# Altium schematic sheet Drives_M.2.SchDoc
size 420 x 297 mm
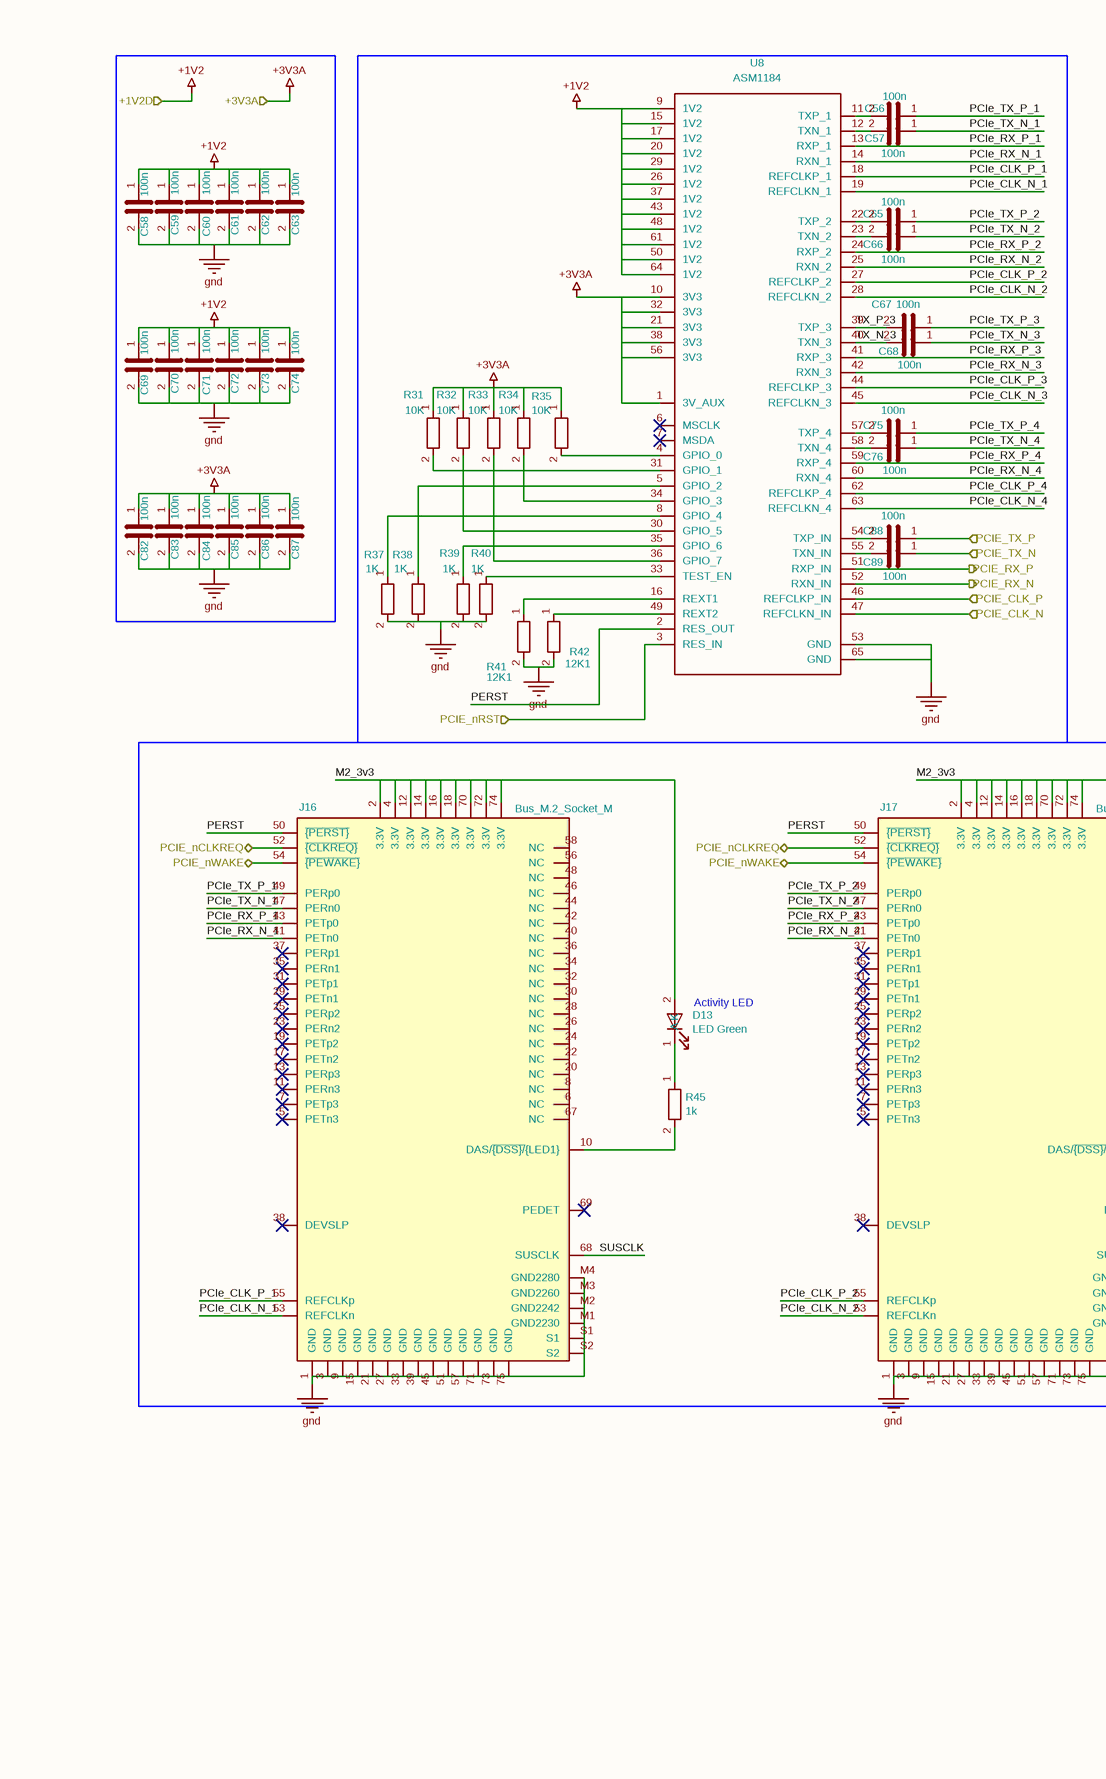
[diagram p0: Drives_M.2.SchDoc, left]
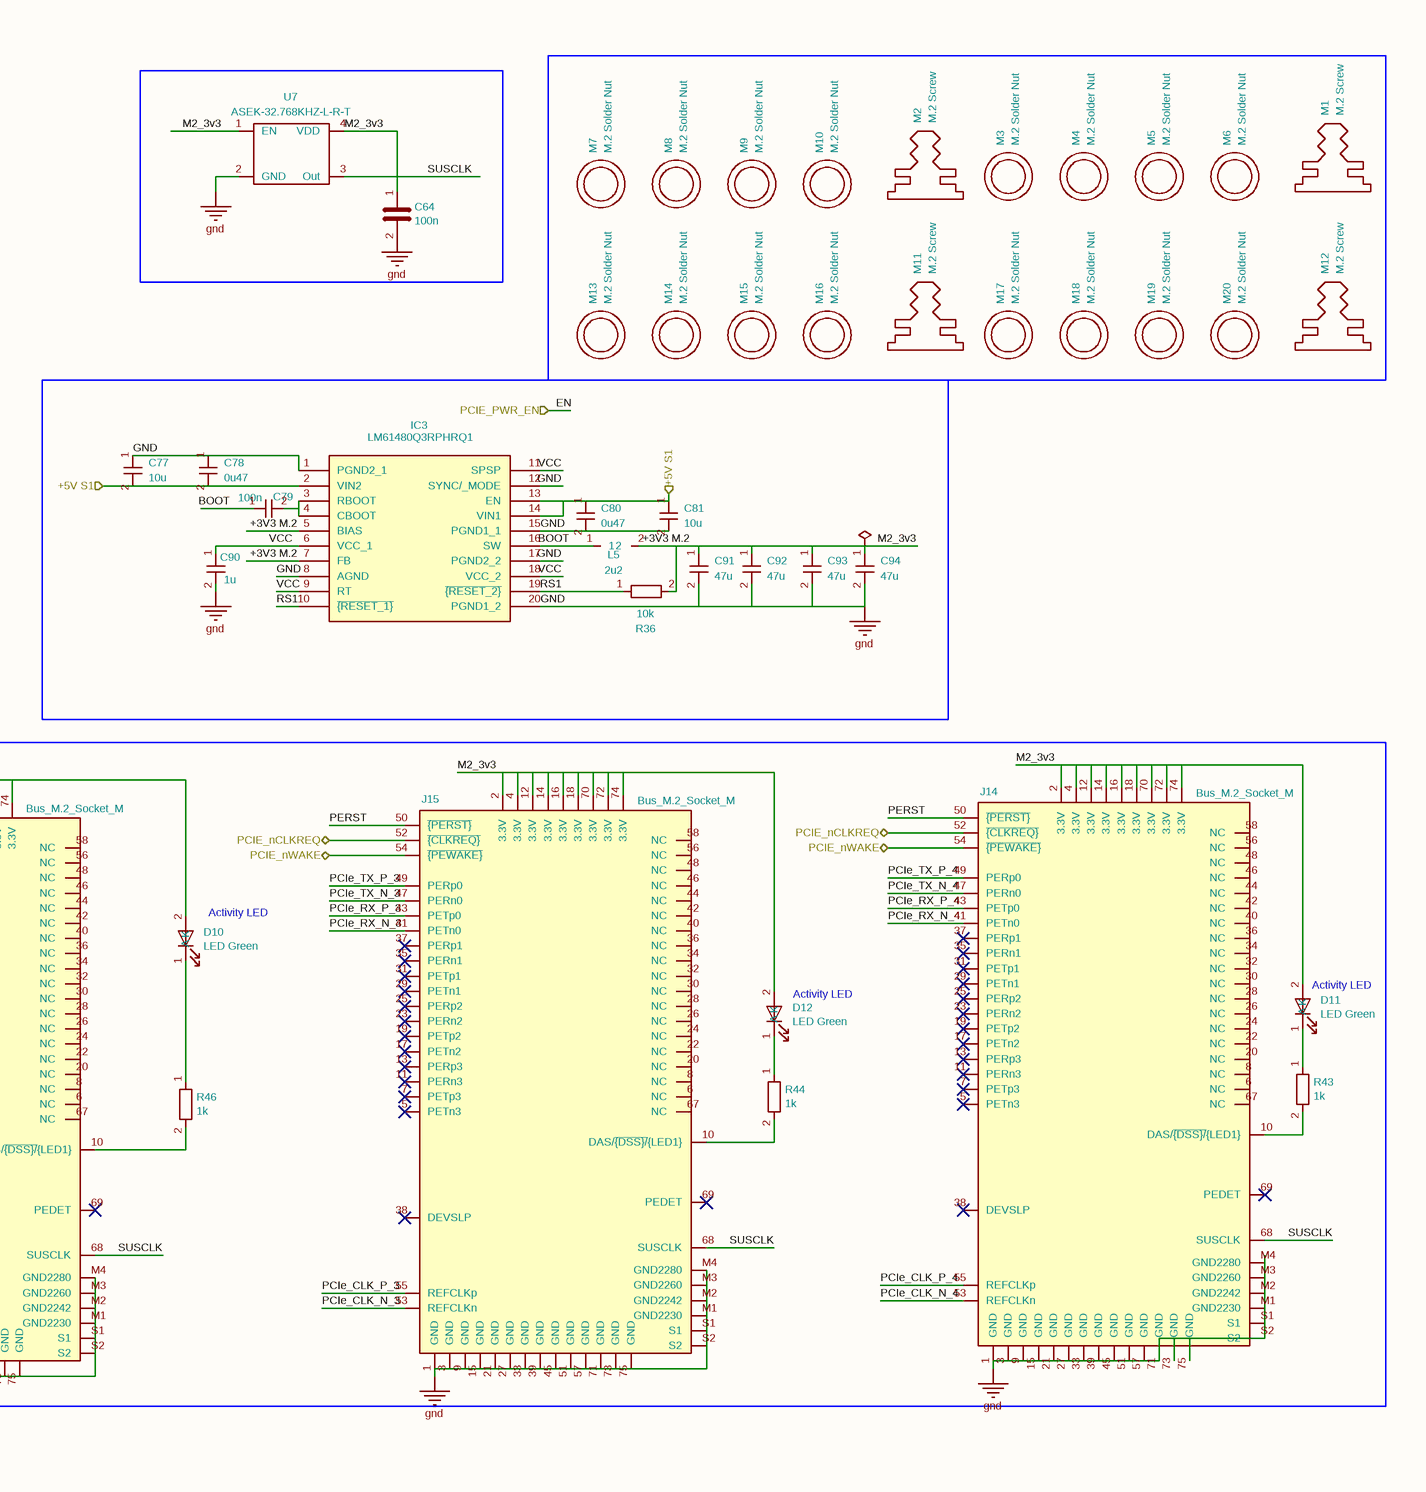
[diagram p1: Drives_M.2.SchDoc, right]

## Parts
#FLG09  PWR_FLAG  (value not drawn)  (graphical)
C56  100n  [C_0402_1005Metric]
C57  100n  [C_0402_1005Metric]
C58  100n  [C_0402_1005Metric]
C59  100n  [C_0402_1005Metric]
C60  100n  [C_0402_1005Metric]
C61  100n  [C_0402_1005Metric]
C62  100n  [C_0402_1005Metric]
C63  100n  [C_0402_1005Metric]
C64  100n  [C_0402_1005Metric]
C65  100n  [C_0402_1005Metric]
C66  100n  [C_0402_1005Metric]
C67  100n  [C_0402_1005Metric]
C68  100n  [C_0402_1005Metric]
C69  100n  [C_0402_1005Metric]
C70  100n  [C_0402_1005Metric]
C71  100n  [C_0402_1005Metric]
C72  100n  [C_0402_1005Metric]
C73  100n  [C_0402_1005Metric]
C74  100n  [C_0402_1005Metric]
C75  100n  [C_0402_1005Metric]
C76  100n  [C_0402_1005Metric]
C77  10u  [C_0805_2012Metric]
C78  0u47  [C_0603_1608Metric]
C79  100n  [C_0402_1005Metric]
C80  0u47  [C_0603_1608Metric]
C81  10u  [C_0805_2012Metric]
C82  100n  [C_0402_1005Metric]
C83  100n  [C_0402_1005Metric]
C84  100n  [C_0402_1005Metric]
C85  100n  [C_0402_1005Metric]
C86  100n  [C_0402_1005Metric]
C87  100n  [C_0402_1005Metric]
C88  100n  [C_0402_1005Metric]
C89  100n  [C_0402_1005Metric]
C90  1u  [C_0805_2012Metric]
C91  47u  [C_0805_2012Metric]
C92  47u  [C_0805_2012Metric]
C93  47u  [C_0805_2012Metric]
C94  47u  [C_0805_2012Metric]
D10  LED Green  [LED_0603_1608Metric]
D11  LED Green  [LED_0603_1608Metric]
D12  LED Green  [LED_0603_1608Metric]
D13  LED Green  [LED_0603_1608Metric]
IC3  LM61480Q3RPHRQ1  [LM62460QRPHRQ1]
J14  Bus_M.2_Socket_M  [21991195]
J15  Bus_M.2_Socket_M  [21991195]
J16  Bus_M.2_Socket_M  [21991195]
J17  Bus_M.2_Socket_M  [21991195]
L5  2u2  [SRN50402R2Y]
M1  M.2 Screw
M2  M.2 Screw
M3  M.2 Solder Nut
M4  M.2 Solder Nut
M5  M.2 Solder Nut
M6  M.2 Solder Nut
M7  M.2 Solder Nut
M8  M.2 Solder Nut
M9  M.2 Solder Nut
M10  M.2 Solder Nut
M11  M.2 Screw
M12  M.2 Screw
M13  M.2 Solder Nut
M14  M.2 Solder Nut
M15  M.2 Solder Nut
M16  M.2 Solder Nut
M17  M.2 Solder Nut
M18  M.2 Solder Nut
M19  M.2 Solder Nut
M20  M.2 Solder Nut
R31  10K  [R_0603_1608Metric]
R32  10K  [R_0603_1608Metric]
R33  10K  [R_0603_1608Metric]
R34  10K  [R_0603_1608Metric]
R35  10K  [R_0603_1608Metric]
R36  10k  [R_0402_1005Metric]
R37  1K  [R_0603_1608Metric]
R38  1K  [R_0603_1608Metric]
R39  1K  [R_0603_1608Metric]
R40  1K  [R_0603_1608Metric]
R41  12K1  [R_0603_1608Metric]
R42  12K1  [R_0603_1608Metric]
R43  1k  [R_0603_1608Metric]
R44  1k  [R_0603_1608Metric]
R45  1k  [R_0603_1608Metric]
R46  1k  [R_0603_1608Metric]
U7  ASEK-32.768KHZ-L-R-T  [Crystal_SMD_3225-4Pin_3.2x2.5mm]
U8  ASM1184  [QFN-64-1EP_9x9mm_P0.5mm_EP5.2x5.2mm_ThermalVias]

## Ports
+1V2D (in), +3V3A (in), +5V S1 (in), PCIE_CLK_N (in), PCIE_CLK_P (in), PCIE_nCLKREQ (bidir), PCIE_nRST (in), PCIE_nWAKE (bidir), PCIE_PWR_EN (in), PCIE_RX_N (out), PCIE_RX_P (out), PCIE_TX_N (in), PCIE_TX_P (in)

## Nets
+1V2: C58.1 C59.1 C60.1 C61.1 C62.1 C63.1 C69.1 C70.1 C71.1 C72.1 C73.1 C74.1 U8.9(1V2) U8.15(1V2) U8.17(1V2) U8.20(1V2) U8.26(1V2) U8.29(1V2) U8.37(1V2) U8.43(1V2) U8.48(1V2) U8.50(1V2) U8.61(1V2) U8.64(1V2) ; port +1V2D
+3V3A: C82.1 C83.1 C84.1 C85.1 C86.1 C87.1 R31.1 R32.1 R33.1 R34.1 R35.1 U8.1(3V_AUX) U8.10(3V3) U8.21(3V3) U8.32(3V3) U8.38(3V3) U8.56(3V3) ; port +3V3A
GND: C58.2 C59.2 C60.2 C61.2 C62.2 C63.2 C64.2 C69.2 C70.2 C71.2 C72.2 C73.2 C74.2 C77.1 C78.1 C80.2 C81.2 C82.2 C83.2 C84.2 C85.2 C86.2 C87.2 C90.2 C91.2 C92.2 C93.2 C94.2 IC3.1(PGND2_1) IC3.8(AGND) IC3.12(SYNC/_MODE) IC3.15(PGND1_1) IC3.17(PGND2_2) IC3.20(PGND1_2) J14.1(GND) J14.3(GND) J14.9(GND) J14.15(GND) J14.21(GND) J14.27(GND) J14.33(GND) J14.39(GND) J14.45(GND) J14.51(GND) J14.57(GND) J14.71(GND) J14.73(GND) J14.75(GND) J14.M1(GND2230) J14.M2(GND2242) J14.M3(GND2260) J14.M4(GND2280) J14.S1 J14.S2 J15.1(GND) J15.3(GND) J15.9(GND) J15.15(GND) J15.21(GND) J15.27(GND) J15.33(GND) J15.39(GND) J15.45(GND) J15.51(GND) J15.57(GND) J15.71(GND) J15.73(GND) J15.75(GND) J15.M1(GND2230) J15.M2(GND2242) J15.M3(GND2260) J15.M4(GND2280) J15.S1 J15.S2 J16.1(GND) J16.3(GND) J16.9(GND) J16.15(GND) J16.21(GND) J16.27(GND) J16.33(GND) J16.39(GND) J16.45(GND) J16.51(GND) J16.57(GND) J16.71(GND) J16.73(GND) J16.75(GND) J16.M1(GND2230) J16.M2(GND2242) J16.M3(GND2260) J16.M4(GND2280) J16.S1 J16.S2 J17.1(GND) J17.3(GND) J17.9(GND) J17.15(GND) J17.21(GND) J17.27(GND) J17.33(GND) J17.39(GND) J17.45(GND) J17.51(GND) J17.57(GND) J17.71(GND) J17.73(GND) J17.75(GND) J17.M1(GND2230) J17.M2(GND2242) J17.M3(GND2260) J17.M4(GND2280) J17.S1 J17.S2 R37.2 R38.2 R39.2 R40.2 R41.2 R42.2 U7.2(GND) U8.53(GND) U8.65(GND)
+3V3 M.2: #FLG09.1 C64.1 C91.1 C92.1 C93.1 C94.1 D10.2(A) D11.2(A) D12.2(A) D13.2(A) IC3.5(BIAS) IC3.7(FB) J14.2(3.3V) J14.4(3.3V) J14.12(3.3V) J14.14(3.3V) J14.16(3.3V) J14.18(3.3V) J14.70(3.3V) J14.72(3.3V) J14.74(3.3V) J15.2(3.3V) J15.4(3.3V) J15.12(3.3V) J15.14(3.3V) J15.16(3.3V) J15.18(3.3V) J15.70(3.3V) J15.72(3.3V) J15.74(3.3V) J16.2(3.3V) J16.4(3.3V) J16.12(3.3V) J16.14(3.3V) J16.16(3.3V) J16.18(3.3V) J16.70(3.3V) J16.72(3.3V) J16.74(3.3V) J17.2(3.3V) J17.4(3.3V) J17.12(3.3V) J17.14(3.3V) J17.16(3.3V) J17.18(3.3V) J17.70(3.3V) J17.72(3.3V) J17.74(3.3V) L5.2 R36.2 U7.1(EN) U7.4(VDD)  [also labelled M2_3v3]
+5V S1: C77.2 C78.2 C80.1 C81.1 IC3.2(VIN2) IC3.13(EN) IC3.14(VIN1) ; port +5V S1
BOOT: C79.1 IC3.16(SW) L5.1
EN: port PCIE_PWR_EN
PCIE_CLK_N: U8.47(REFCLKN_IN) ; port PCIE_CLK_N
PCIe_CLK_N_1: J16.53(REFCLKn) U8.19(REFCLKN_1)
PCIe_CLK_N_2: J17.53(REFCLKn) U8.28(REFCLKN_2)
PCIe_CLK_N_3: J15.53(REFCLKn) U8.45(REFCLKN_3)
PCIe_CLK_N_4: J14.53(REFCLKn) U8.63(REFCLKN_4)
PCIE_CLK_P: U8.46(REFCLKP_IN) ; port PCIE_CLK_P
PCIe_CLK_P_1: J16.55(REFCLKp) U8.18(REFCLKP_1)
PCIe_CLK_P_2: J17.55(REFCLKp) U8.27(REFCLKP_2)
PCIe_CLK_P_3: J15.55(REFCLKp) U8.44(REFCLKP_3)
PCIe_CLK_P_4: J14.55(REFCLKp) U8.62(REFCLKP_4)
PCIE_nCLKREQ: J14.52(~{{CLKREQ}}) J15.52(~{{CLKREQ}}) J16.52(~{{CLKREQ}}) J17.52(~{{CLKREQ}}) ; port PCIE_nCLKREQ
PCIE_nRST: U8.3(RES_IN) ; port PCIE_nRST
PCIE_nWAKE: J14.54(~{{PEWAKE}}) J15.54(~{{PEWAKE}}) J16.54(~{{PEWAKE}}) J17.54(~{{PEWAKE}}) ; port PCIE_nWAKE
PCIE_RX_N: U8.52(RXN_IN) ; port PCIE_RX_N
PCIe_RX_N_1: J16.41(PETn0) U8.14(RXN_1)
PCIe_RX_N_2: J17.41(PETn0) U8.25(RXN_2)
PCIe_RX_N_3: J15.41(PETn0) U8.42(RXN_3)
PCIe_RX_N_4: J14.41(PETn0) U8.60(RXN_4)
PCIE_RX_P: U8.51(RXP_IN) ; port PCIE_RX_P
PCIe_RX_P_1: J16.43(PETp0) U8.13(RXP_1)
PCIe_RX_P_2: J17.43(PETp0) U8.24(RXP_2)
PCIe_RX_P_3: J15.43(PETp0) U8.41(RXP_3)
PCIe_RX_P_4: J14.43(PETp0) U8.59(RXP_4)
PCIE_TX_N: C89.1 ; port PCIE_TX_N
PCIe_TX_N_1: C57.1 J16.47(PERn0)
PCIe_TX_N_2: C66.1 J17.47(PERn0)
PCIe_TX_N_3: C68.1 J15.47(PERn0)
PCIe_TX_N_4: C76.1 J14.47(PERn0)
PCIE_TX_P: C88.1 ; port PCIE_TX_P
PCIe_TX_P_1: C56.1 J16.49(PERp0)
PCIe_TX_P_2: C65.1 J17.49(PERp0)
PCIe_TX_P_3: C67.1 J15.49(PERp0)
PCIe_TX_P_4: C75.1 J14.49(PERp0)
PERST: J14.50(~{{PERST}}) J15.50(~{{PERST}}) J16.50(~{{PERST}}) J17.50(~{{PERST}}) U8.2(RES_OUT)
RS1: IC3.10(~{{RESET_1}}) IC3.19(~{{RESET_2}}) R36.1
SUSCLK: J14.68(SUSCLK) J15.68(SUSCLK) J16.68(SUSCLK) J17.68(SUSCLK) U7.3(Out)
TX_N_3: C68.2 U8.40(TXN_3)
TX_P_3: C67.2 U8.39(TXP_3)
VCC: C90.1 IC3.6(VCC_1) IC3.9(RT) IC3.11(SPSP) IC3.18(VCC_2)
NetC56_2: C56.2 U8.11(TXP_1)
NetC57_2: C57.2 U8.12(TXN_1)
NetC65_2: C65.2 U8.22(TXP_2)
NetC66_2: C66.2 U8.23(TXN_2)
NetC75_2: C75.2 U8.57(TXP_4)
NetC76_2: C76.2 U8.58(TXN_4)
NetC79_2: C79.2 IC3.3(RBOOT) IC3.4(CBOOT)
NetC88_2: C88.2 U8.54(TXP_IN)
NetC89_2: C89.2 U8.55(TXN_IN)
NetD10_1: D10.1(K) R46.1
NetD11_1: D11.1(K) R43.1
NetD12_1: D12.1(K) R44.1
NetD13_1: D13.1(K) R45.1
NetJ14_10: J14.10(DAS/~{{DSS}/}{LED1}) R43.2
NetJ15_10: J15.10(DAS/~{{DSS}/}{LED1}) R44.2
NetJ16_10: J16.10(DAS/~{{DSS}/}{LED1}) R45.2
NetJ17_10: J17.10(DAS/~{{DSS}/}{LED1}) R46.2
NetR31_2: R31.2 U8.31(GPIO_1)
NetR32_2: R32.2 U8.30(GPIO_5)
NetR33_2: R33.2 U8.36(GPIO_7)
NetR34_2: R34.2 U8.34(GPIO_3)
NetR35_2: R35.2 U8.4(GPIO_0)
NetR37_1: R37.1 U8.8(GPIO_4)
NetR38_1: R38.1 U8.5(GPIO_2)
NetR39_1: R39.1 U8.35(GPIO_6)
NetR40_1: R40.1 U8.33(TEST_EN)
NetR41_1: R41.1 U8.16(REXT1)
NetR42_1: R42.1 U8.49(REXT2)

Not connected (* = marked no-connect by the designer): J14 5(PETn3)* 6(NC) 7(PETp3)* 8(NC) 11(PERn3)* 13(PERp3)* 17(PETn2)* 19(PETp2)* 20(NC) 22(NC) 23(PERn2)* 24(NC) 25(PERp2)* 26(NC) 28(NC) 29(PETn1)* 30(NC) 31(PETp1)* 32(NC) 34(NC) 35(PERn1)* 36(NC) 37(PERp1)* 38(DEVSLP)* 40(NC) 42(NC) 44(NC) 46(NC) 48(NC) 56(NC) 58(NC) 67(NC) 69(PEDET)*; J15 5(PETn3)* 6(NC) 7(PETp3)* 8(NC) 11(PERn3)* 13(PERp3)* 17(PETn2)* 19(PETp2)* 20(NC) 22(NC) 23(PERn2)* 24(NC) 25(PERp2)* 26(NC) 28(NC) 29(PETn1)* 30(NC) 31(PETp1)* 32(NC) 34(NC) 35(PERn1)* 36(NC) 37(PERp1)* 38(DEVSLP)* 40(NC) 42(NC) 44(NC) 46(NC) 48(NC) 56(NC) 58(NC) 67(NC) 69(PEDET)*; J16 5(PETn3)* 6(NC) 7(PETp3)* 8(NC) 11(PERn3)* 13(PERp3)* 17(PETn2)* 19(PETp2)* 20(NC) 22(NC) 23(PERn2)* 24(NC) 25(PERp2)* 26(NC) 28(NC) 29(PETn1)* 30(NC) 31(PETp1)* 32(NC) 34(NC) 35(PERn1)* 36(NC) 37(PERp1)* 38(DEVSLP)* 40(NC) 42(NC) 44(NC) 46(NC) 48(NC) 56(NC) 58(NC) 67(NC) 69(PEDET)*; J17 5(PETn3)* 6(NC) 7(PETp3)* 8(NC) 11(PERn3)* 13(PERp3)* 17(PETn2)* 19(PETp2)* 20(NC) 22(NC) 23(PERn2)* 24(NC) 25(PERp2)* 26(NC) 28(NC) 29(PETn1)* 30(NC) 31(PETp1)* 32(NC) 34(NC) 35(PERn1)* 36(NC) 37(PERp1)* 38(DEVSLP)* 40(NC) 42(NC) 44(NC) 46(NC) 48(NC) 56(NC) 58(NC) 67(NC) 69(PEDET)*; U8 6(MSCLK)* 7(MSDA)*

## Notes on the sheet
- (near D10) Activity LED
- (near D13) Activity LED
- (near D12) Activity LED
- (near D11) Activity LED
- 1
- 2
- 3
- 4
- 5
- 6
- 7
- 8
- A
- B
- C
- D
- E
- Title:
- File: Drives_M.2.kicad_sch
- Sheet: /
- F
- KiCad E.D.A.  kicad (5.1.4)-1
- Size: A3
- Date:
- Rev:
- Id: 1/1

## Library data of the parts
#FLG09 = PWR_FLAG: Description: Special symbol for telling ERC where power comes from; Value: PWR_FLAG
C56-C63 C65-C76 C82-C89 = C: Value: 100n; Footprint: Capacitor_SMD:C_0402_1005Metric
C64 = C: Part Description: 0.1uF 10% 16V Ceramic Capacitor X7R 0402 (1005 Metric); Field4: Farnell; Field5: 2611911; Field6: RM EMK105 B7104KV-F; Field7: TAIYO YUDEN EUROPE GMBH; Field8: 110091611; Value: 100n; Footprint: Capacitor_SMD:C_0402_1005Metric
C77-C81 C90-C94 = C_Small: Description: Unpolarized capacitor, small symbol
  C77 C81: Value: 10u; Footprint: Capacitor_SMD:C_0805_2012Metric
  C78 C80: Value: 0u47; Footprint: Capacitor_SMD:C_0603_1608Metric
  C79: Value: 100n; Footprint: Capacitor_SMD:C_0402_1005Metric
  C90: Value: 1u; Footprint: Capacitor_SMD:C_0805_2012Metric
  C91-C94: Value: 47u; Footprint: Capacitor_SMD:C_0805_2012Metric
D10-D13 = LED: Part Description: Green 572nm LED Indication - Discrete 2.2V 2-SMD, No Lead; Field4: Digikey; Field5: LTST-S270KGKT; Field6: SML-A12M8TT86N; Field7: Rohm; Field8: 650263301; Value: LED Green; Footprint: LED_SMD:LED_0603_1608Metric
IC3 = LM61480Q3RPHRQ1: Manufacturer_Name: Texas Instruments; Description: Switching Voltage Regulators 8-A automotive buck converter optimized for power density and low EMI; Height: 1; Manufacturer_Part_Number: LM61480Q3RPHRQ1; Mouser Part Number: 595-LM61480Q3RPHRQ1; Mouser Price/Stock: https://www.mouser.co.uk/ProductDetail/Texas-Instruments/LM61480Q3RPHRQ1?qs=Wj%2FVkw3K%252BMDMY%2FXxTFEmEg%3D%3D; Arrow Part Number: LM61480Q3RPHRQ1; Arrow Price/Stock: https://www.arrow.com/en/products/lm61480q3rphrq1/texas-instruments?utm_currency=USD&region=nac; Value: LM61480Q3RPHRQ1; Footprint: LIB_LM61480Q3RPHRQ1:LM62460QRPHRQ1
J14-J17 = Bus_M.2_Socket_M: Part Description: M.2 M Key connector; Description: M.2 Socket 3 Mechanical Key M; Field5: MTSSD03-67MSW337; Field7: MTCONN; Field6: MTSSD03-67MSW337; Value: Bus_M.2_Socket_M; Footprint: 2199119-5:21991195
L5 = L: Description: Inductor; Value: 2u2; Footprint: SRN5040-2R2Y:SRN50402R2Y
M1 M2 M11 M12 = M.2_Screw: Part Description: M.2 Screw; Value: M.2 Screw
M3-M10 M13-M20 = SolderNut: Part Description: Solder nut for M.2 slot; Value: M.2 Solder Nut
R31-R35 R37-R42 = R: Footprint: Resistor_SMD:R_0603_1608Metric
  R31-R35: Value: 10K
  R37-R40: Value: 1K
  R41 R42: Value: 12K1
R36 = R: Description: Resistor; Value: 10k; Footprint: Resistor_SMD:R_0402_1005Metric
R43-R46 = R: Part Description: Resistor 1K M1005 1% 63mW; Field4: Farnell; Field5: 9239235; Field7: KOA EUROPE GMBH; Field6: RK73H1ETTP1001F; Field8: 125049511; Value: 1k; Footprint: Resistor_SMD:R_0603_1608Metric
U7 = ASEK-32.768KHZ-L-R-T: Part Description: 32KHz Xtal oscilator; Field7: abracon; Field5: ASEK-32.768KHZ-L-R-T; Field6: ASEK-32.768KHZ-L-R-T; Value: ASEK-32.768KHZ-L-R-T; Footprint: Crystal:Crystal_SMD_3225-4Pin_3.2x2.5mm
U8 = ASM1184: Value: ASM1184; Footprint: Package_DFN_QFN:QFN-64-1EP_9x9mm_P0.5mm_EP5.2x5.2mm_ThermalVias